# EAGLE schematic ChairControl (EAGLE 8.6.0)
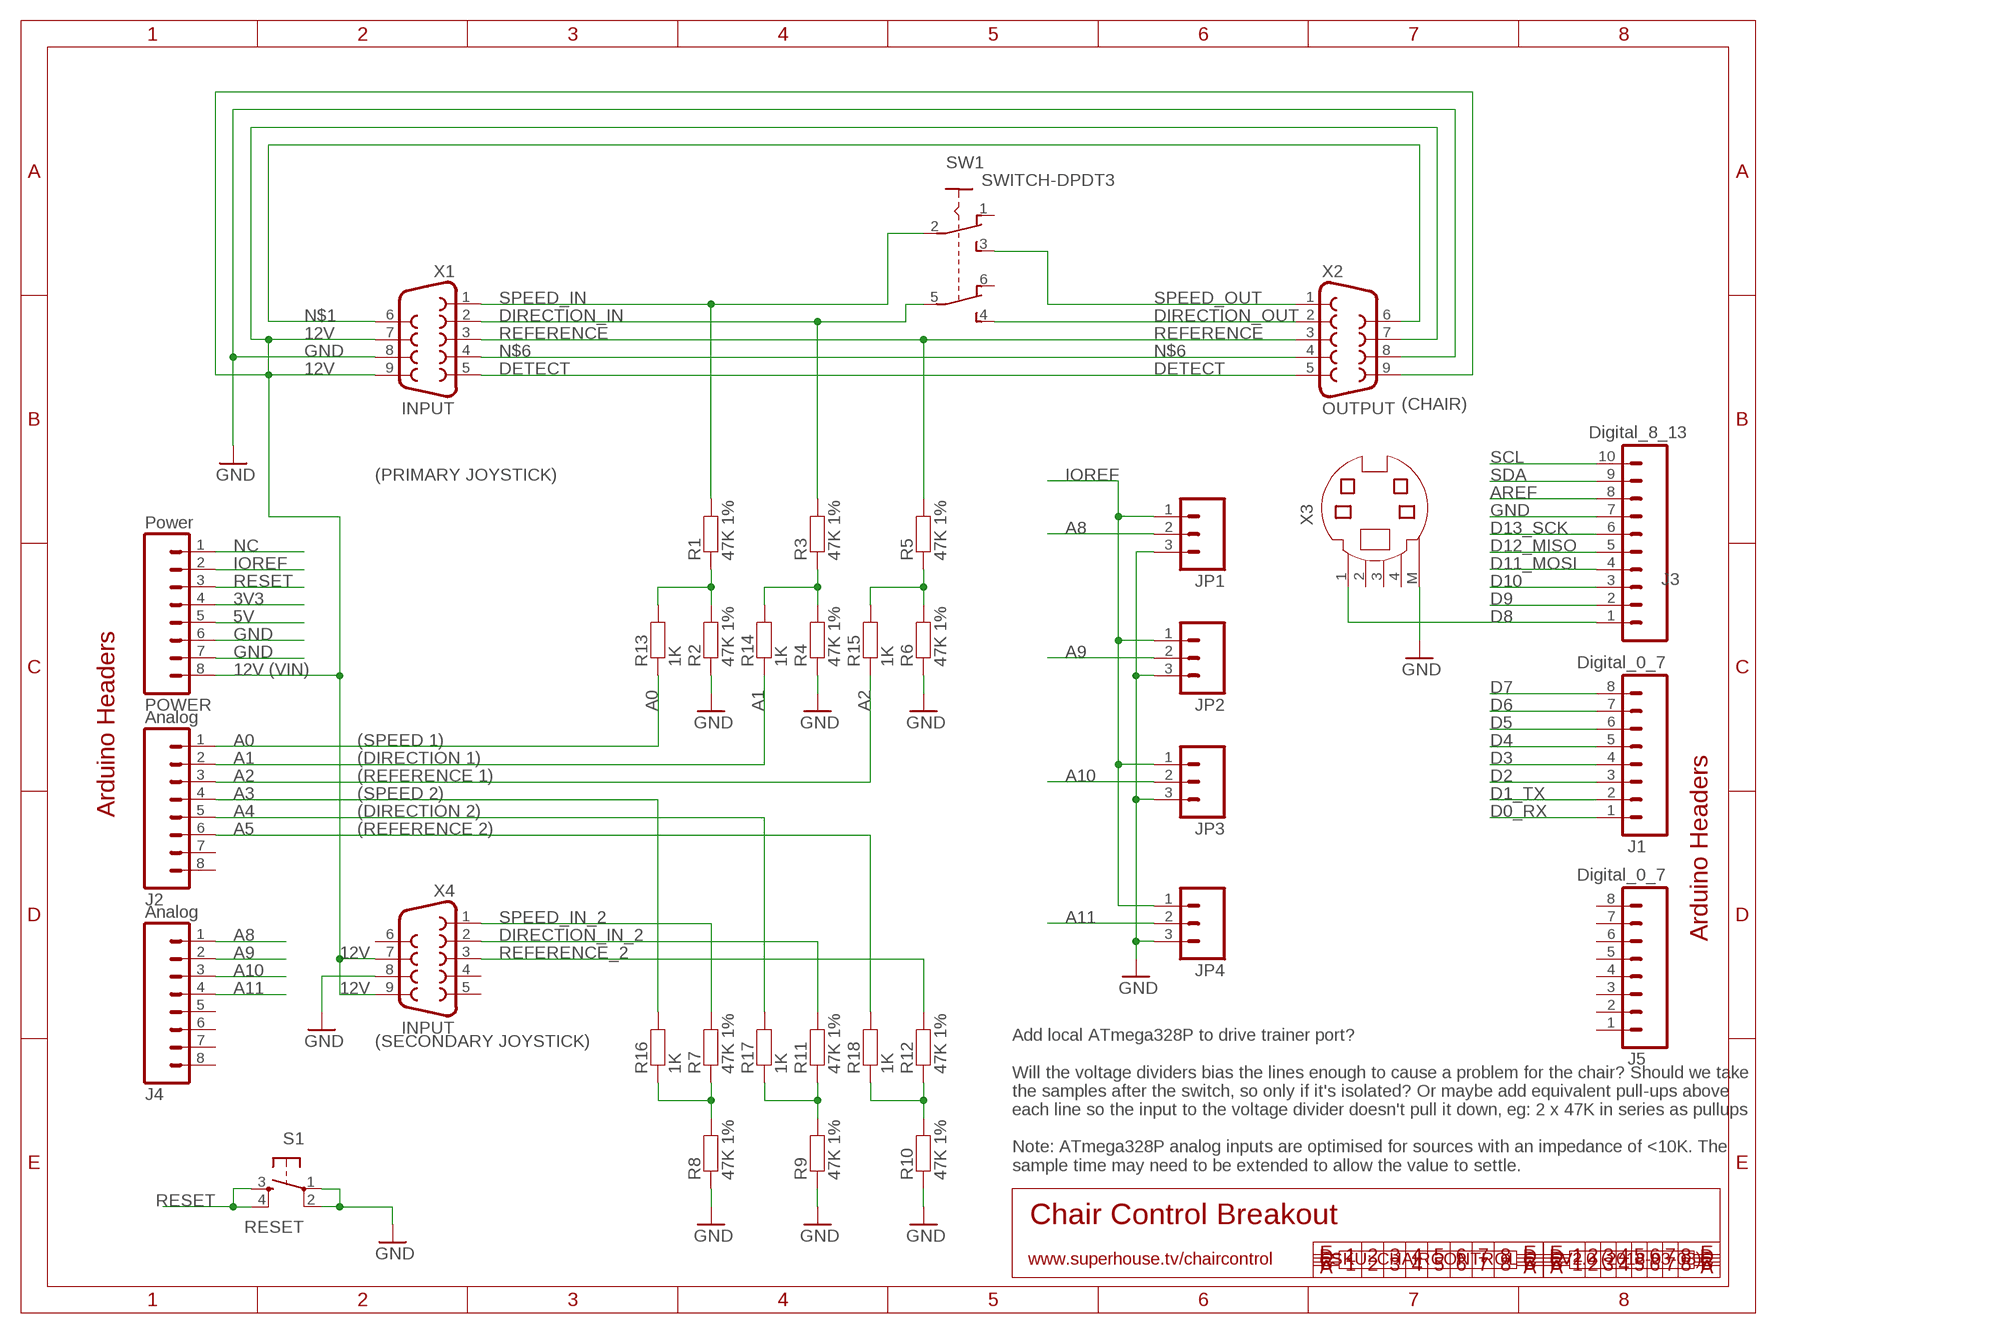
[diagram p0: schematic, sheet 1]

## Parts
J1  Digital_0_7  M08  [1X08]
J2  Analog  M08PTH  [1X08]
J3  Digital_8_13  M100.1  [1X10]
J4  Analog  M08PTH  [1X08]
J5  Digital_0_7  M08  [1X08]
JP1  M03PTH  [1X03]
JP2  M03PTH  [1X03]
JP3  M03PTH  [1X03]
JP4  M03PTH  [1X03]
POWER  Power  M08  [1X08]
R1  47K 1%  RESISTOR0603  [0603]
R2  47K 1%  RESISTOR0603  [0603]
R3  47K 1%  RESISTOR0603  [0603]
R4  47K 1%  RESISTOR0603  [0603]
R5  47K 1%  RESISTOR0603  [0603]
R6  47K 1%  RESISTOR0603  [0603]
R7  47K 1%  RESISTOR0603  [0603]
R8  47K 1%  RESISTOR0603  [0603]
R9  47K 1%  RESISTOR0603  [0603]
R10  47K 1%  RESISTOR0603  [0603]
R11  47K 1%  RESISTOR0603  [0603]
R12  47K 1%  RESISTOR0603  [0603]
R13  1K  RESISTOR0603  [0603]
R14  1K  RESISTOR0603  [0603]
R15  1K  RESISTOR0603  [0603]
R16  1K  RESISTOR0603  [0603]
R17  1K  RESISTOR0603  [0603]
R18  1K  RESISTOR0603  [0603]
S1  RESET  TAC_SWITCHPTH  [TACTILE-PTH]
SW1  SWITCH-DPDT3  [7201SD9AV2BE]
X1  INPUT  DB9MALE  [DB9_MALE]
X2  OUTPUT  DB9FEMALE  [DB9]
X3  MD04S  [MDIN04S]
X4  INPUT  DB9MALE  [DB9_MALE]

## Nets
3V3: POWER.4
5V: POWER.5
12V: POWER.8 X1.7 X1.9 X2.7 X2.9 X4.7 X4.9
A0: J2.1 R13.1
A1: J2.2 R14.1
A2: J2.3 R15.1
A3: J2.4 R16.2
A4: J2.5 R17.2
A5: J2.6 R18.2
A8: J4.1 JP1.2
A9: J4.2 JP2.2
A10: J4.3 JP3.2
A11: J4.4 JP4.2
AREF: J3.8
D0_RX: J1.1
D1_TX: J1.2
D2: J1.3
D3: J1.4
D4: J1.5
D5: J1.6
D6: J1.7
D7: J1.8
D8: J3.1 X3.1
D9: J3.2
D10: J3.3
D11_MOSI: J3.4
D12_MISO: J3.5
D13_SCK: J3.6
DETECT: X1.5 X2.5
DIRECTION_IN: R3.2 SW1.5 X1.2
DIRECTION_IN_2: R11.2 X4.2
DIRECTION_OUT: SW1.4 X2.2
GND: J3.7 JP1.3 JP2.3 JP3.3 JP4.3 POWER.6 POWER.7 R2.1 R4.1 R6.1 R8.1 R9.1 R10.1 S1.1 S1.2 X1.8 X2.8 X3.M X4.8
IOREF: JP1.1 JP2.1 JP3.1 JP4.1 POWER.2
N$1: X1.6 X2.6
N$2: R1.1 R2.2 R13.2
N$3: R3.1 R4.2 R14.2
N$4: R5.1 R6.2 R15.2
N$6: X1.4 X2.4
N$7: R7.1 R8.2 R16.1
N$8: R9.2 R11.1 R17.1
N$9: R10.2 R12.1 R18.1
NC: POWER.1
REFERENCE: R5.2 X1.3 X2.3
REFERENCE_2: R12.2 X4.3
RESET: POWER.3 S1.3 S1.4
SCL: J3.10
SDA: J3.9
SPEED_IN: R1.2 SW1.2 X1.1
SPEED_IN_2: R7.2 X4.1
SPEED_OUT: SW1.3 X2.1
Unconnected: J2.7 J2.8 J4.5 J4.6 J4.7 J4.8 J5.1 J5.2 J5.3 J5.4 J5.5 J5.6 J5.7 J5.8 SW1.1 SW1.6 X3.2 X3.3 X3.4 X4.4 X4.5 X4.6

## Notes on the sheet
- (CHAIR)
- (PRIMARY JOYSTICK)
- (VIN)
- (SPEED 1)
- (DIRECTION 1)
- (REFERENCE 1)
- (SPEED 2)
- Arduino Headers | (DIRECTION 2)
- (REFERENCE 2)
- Arduino Headers
- (SECONDARY JOYSTICK)
- Add local ATmega328P to drive trainer port?
  
  Will the voltage dividers bias the lines enough to cause a problem for the chair? Should we take
  the samples after the switch, so only if it's isolated? Or maybe add equivalent pull-ups above
  each line so the input to the voltage divider doesn't pull it down, eg: 2 x 47K in series as pullups
  
  Note: ATmega328P analog inputs are optimised for sources with an impedance of <10K. The
  sample time may need to be extended to allow the value to settle.
- Chair Control Breakout
- www.superhouse.tv/chaircontrol | SKU: CHAIRCONTROL | V2.0 (2018-03-03)

## Library data of the parts
J1 J5 = freetronics:M08: Header 8 Standard 8-pin 0.1" header. Use with straight break away headers (SKU : PRT-00116), right angle break away headers (PRT-00553), swiss pins (PRT-00743), machine pins (PRT-00117), and female headers (PRT-00115).
J2 J4 = freetronics-jon:M08: Header 8 Standard 8-pin 0.1" header. Use with straight break away headers (SKU : PRT-00116), right angle break away headers (PRT-00553), swiss pins (PRT-00743), machine pins (PRT-00117), and female headers (PRT-00115).
J3 = freetronics-original:M10: Header 10 Standard 10-pin 0.1" header. Use with straight break away headers (SKU : PRT-00116), right angle break away headers (PRT-00553), swiss pins (PRT-00743), machine pins (PRT-00117), and female headers (PRT-00115).
JP1-JP4 = freetronics-jon:M03: Header 3 Standard 3-pin 0.1" header. Use with straight break away headers (SKU : PRT-00116), right angle break away headers (PRT-00553), swiss pins (PRT-00743), machine pins (PRT-00117), and female headers (PRT-00115). Molex polarized connector foot print use with SKU : PRT-08232 with associated crimp pins and housings.
POWER = freetronics-original:M08: Header 8 Standard 8-pin 0.1" header. Use with straight break away headers (SKU : PRT-00116), right angle break away headers (PRT-00553), swiss pins (PRT-00743), machine pins (PRT-00117), and female headers (PRT-00115).
R1-R18 = freetronics-jon:RESISTOR: Resistor Basic schematic elements and footprints for 0603, 1206, and PTH 1/10th watt (small) resistors.
S1 = freetronics:TAC_SWITCH: Momentary Switch Button commonly used for reset or general input. Spark Fun Electronics SKU : COM-00097
SW1 = freetronics-jon:SWITCH-DPDT
X1 X2 X4 = SparkFun-Connectors:DB9: DB9 Connector Standard DB9 (D-Sub 9) serial connector. Can be used for CAN bus as well as RS485 and RS232. Footprint production proven. Spark Fun Electronics SKU : PRT-00429
X3 = freetronics-jon:MD04S: YAMAICHI CONNECTOR; OC_FARNELL: unknown; OC_NEWARK: unknown